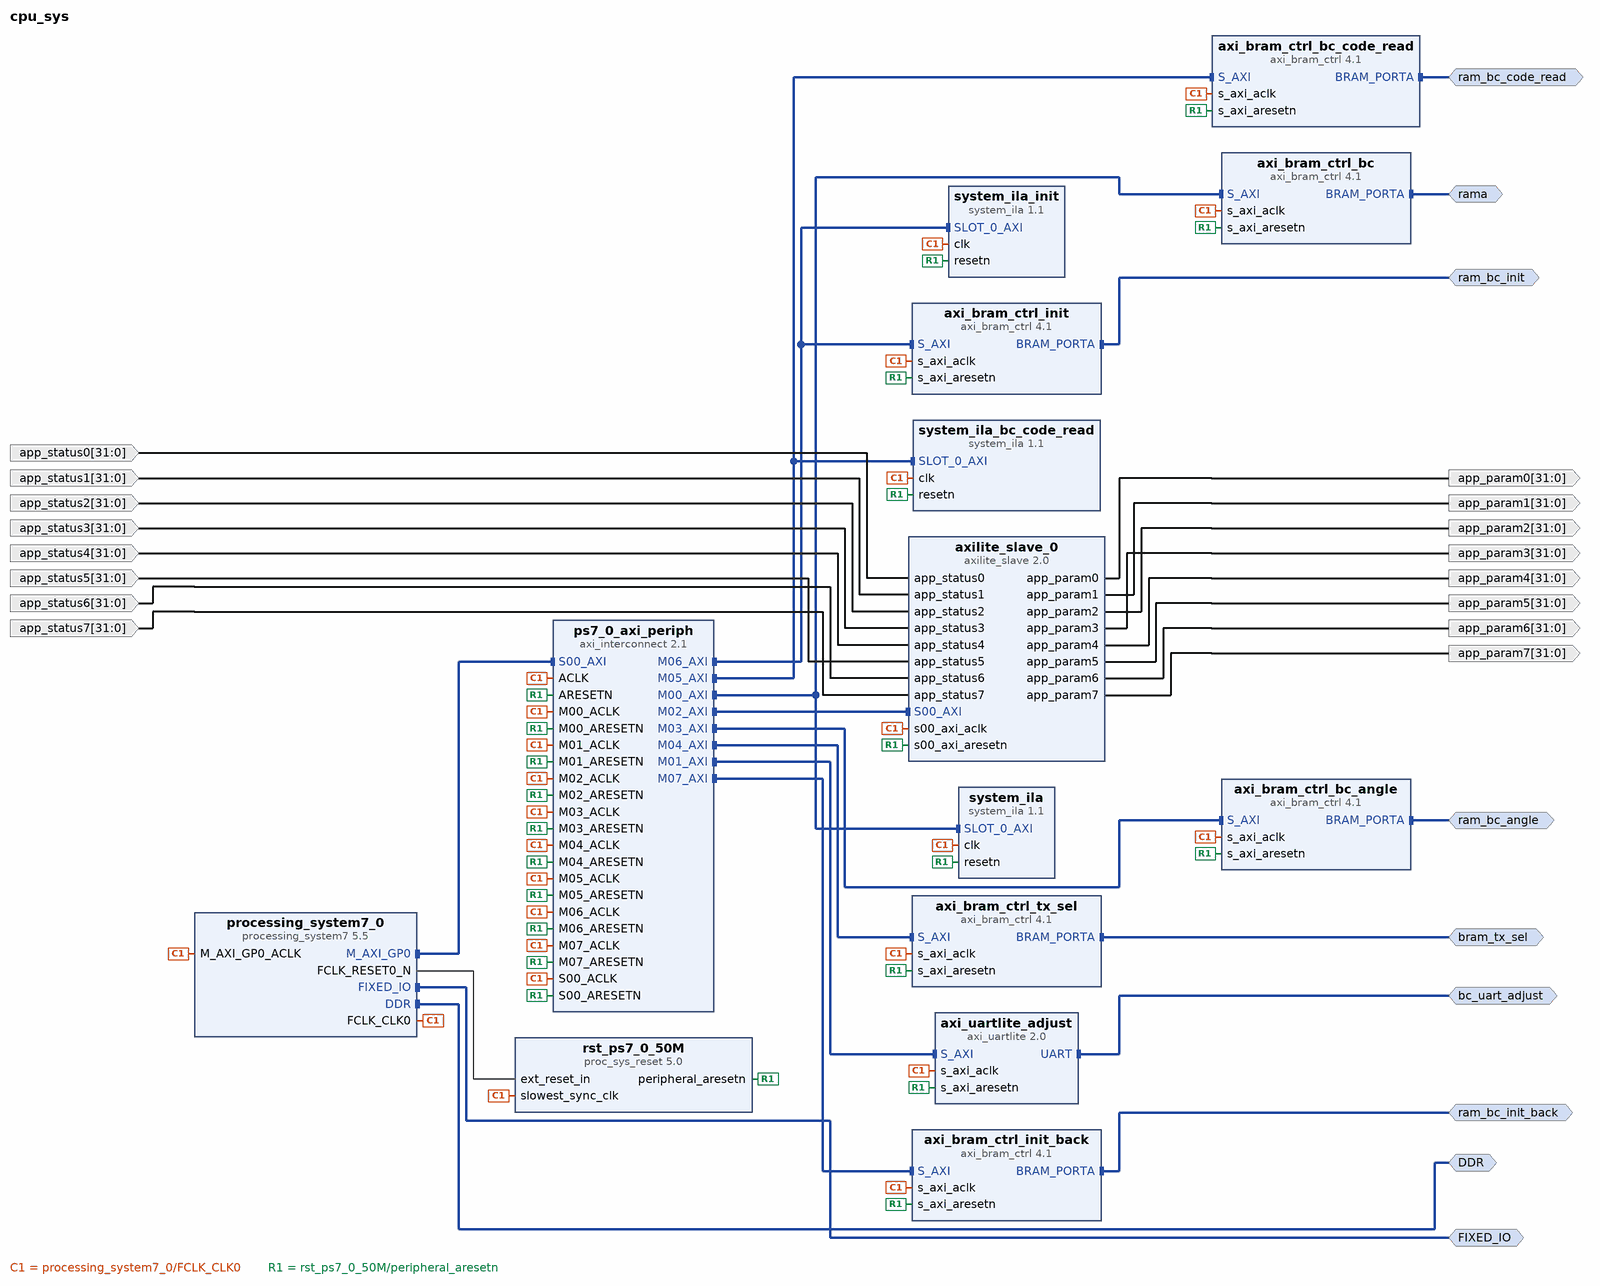
[diagram p0: block diagram of the top level]
# Vivado block design cpu_sys, xc7z020clg400-2, Vivado 2020.2
create_bd_design cpu_sys

create_bd_intf_port -mode Master -vlnv xilinx.com:interface:ddrx_rtl:1.0 DDR
create_bd_intf_port -mode Master -vlnv xilinx.com:display_processing_system7:fixedio_rtl:1.0 FIXED_IO
create_bd_intf_port -mode Master -vlnv xilinx.com:interface:uart_rtl:1.0 bc_uart_adjust
create_bd_intf_port -mode Master -vlnv xilinx.com:interface:bram_rtl:1.0 rama
set_property -dict {CONFIG.MASTER_TYPE BRAM_CTRL} [get_bd_intf_ports rama]
create_bd_intf_port -mode Master -vlnv xilinx.com:interface:bram_rtl:1.0 ram_bc_angle
set_property -dict {CONFIG.MASTER_TYPE BRAM_CTRL} [get_bd_intf_ports ram_bc_angle]
create_bd_intf_port -mode Master -vlnv xilinx.com:interface:bram_rtl:1.0 bram_tx_sel
set_property -dict {CONFIG.MASTER_TYPE BRAM_CTRL} [get_bd_intf_ports bram_tx_sel]
create_bd_intf_port -mode Master -vlnv xilinx.com:interface:bram_rtl:1.0 ram_bc_code_read
set_property -dict {CONFIG.MASTER_TYPE BRAM_CTRL} [get_bd_intf_ports ram_bc_code_read]
create_bd_intf_port -mode Master -vlnv xilinx.com:interface:bram_rtl:1.0 ram_bc_init
set_property -dict {CONFIG.MASTER_TYPE BRAM_CTRL} [get_bd_intf_ports ram_bc_init]
create_bd_intf_port -mode Master -vlnv xilinx.com:interface:bram_rtl:1.0 ram_bc_init_back
set_property -dict {CONFIG.MASTER_TYPE BRAM_CTRL} [get_bd_intf_ports ram_bc_init_back]
create_bd_port -dir O -from 31 -to 0 app_param0
create_bd_port -dir O -from 31 -to 0 app_param1
create_bd_port -dir O -from 31 -to 0 app_param2
create_bd_port -dir O -from 31 -to 0 app_param3
create_bd_port -dir O -from 31 -to 0 app_param4
create_bd_port -dir O -from 31 -to 0 app_param5
create_bd_port -dir O -from 31 -to 0 app_param6
create_bd_port -dir O -from 31 -to 0 app_param7
create_bd_port -dir I -from 31 -to 0 app_status0
create_bd_port -dir I -from 31 -to 0 app_status1
create_bd_port -dir I -from 31 -to 0 app_status2
create_bd_port -dir I -from 31 -to 0 app_status3
create_bd_port -dir I -from 31 -to 0 app_status4
create_bd_port -dir I -from 31 -to 0 app_status5
create_bd_port -dir I -from 31 -to 0 app_status6
create_bd_port -dir I -from 31 -to 0 app_status7

create_bd_cell -type ip -vlnv xilinx.com:ip:processing_system7:5.5 processing_system7_0
set_property -dict [list \
  CONFIG.PCW_APU_PERIPHERAL_FREQMHZ 666.666666 \
  CONFIG.PCW_CPU_CPU_6X4X_MAX_RANGE 767 \
  CONFIG.PCW_ENET0_ENET0_IO {MIO 16 .. 27} \
  CONFIG.PCW_ENET0_GRP_MDIO_ENABLE 1 \
  CONFIG.PCW_ENET0_GRP_MDIO_IO {MIO 52 .. 53} \
  CONFIG.PCW_ENET0_PERIPHERAL_ENABLE 1 \
  CONFIG.PCW_ENET0_RESET_ENABLE 0 \
  CONFIG.PCW_ENET_RESET_ENABLE 1 \
  CONFIG.PCW_ENET_RESET_SELECT {Share reset pin} \
  CONFIG.PCW_FPGA0_PERIPHERAL_FREQMHZ 50 \
  CONFIG.PCW_FPGA1_PERIPHERAL_FREQMHZ 50 \
  CONFIG.PCW_GPIO_MIO_GPIO_ENABLE 1 \
  CONFIG.PCW_GPIO_MIO_GPIO_IO MIO \
  CONFIG.PCW_I2C0_GRP_INT_ENABLE 0 \
  CONFIG.PCW_I2C0_I2C0_IO {MIO 50 .. 51} \
  CONFIG.PCW_I2C0_PERIPHERAL_ENABLE 1 \
  CONFIG.PCW_I2C_PERIPHERAL_FREQMHZ 111.111115 \
  CONFIG.PCW_I2C_RESET_ENABLE 1 \
  CONFIG.PCW_I2C_RESET_SELECT {Share reset pin} \
  CONFIG.PCW_PERIPHERAL_BOARD_PRESET None \
  CONFIG.PCW_PRESET_BANK1_VOLTAGE {LVCMOS 1.8V} \
  CONFIG.PCW_QSPI_GRP_FBCLK_ENABLE 1 \
  CONFIG.PCW_QSPI_GRP_FBCLK_IO {MIO 8} \
  CONFIG.PCW_QSPI_GRP_SINGLE_SS_ENABLE 1 \
  CONFIG.PCW_QSPI_GRP_SINGLE_SS_IO {MIO 1 .. 6} \
  CONFIG.PCW_QSPI_PERIPHERAL_ENABLE 1 \
  CONFIG.PCW_QSPI_QSPI_IO {MIO 1 .. 6} \
  CONFIG.PCW_SD0_GRP_CD_ENABLE 1 \
  CONFIG.PCW_SD0_GRP_CD_IO {MIO 47} \
  CONFIG.PCW_SD0_GRP_WP_ENABLE 0 \
  CONFIG.PCW_SD0_PERIPHERAL_ENABLE 1 \
  CONFIG.PCW_SD0_SD0_IO {MIO 40 .. 45} \
  CONFIG.PCW_SDIO_PERIPHERAL_FREQMHZ 100 \
  CONFIG.PCW_SINGLE_QSPI_DATA_MODE x4 \
  CONFIG.PCW_UART0_PERIPHERAL_ENABLE 1 \
  CONFIG.PCW_UART0_UART0_IO {MIO 10 .. 11} \
  CONFIG.PCW_UART1_PERIPHERAL_ENABLE 1 \
  CONFIG.PCW_UART1_UART1_IO {MIO 12 .. 13} \
  CONFIG.PCW_UART_PERIPHERAL_FREQMHZ 100 \
  CONFIG.PCW_UIPARAM_DDR_FREQ_MHZ 533.333333 \
  CONFIG.PCW_UIPARAM_DDR_PARTNO {MT41J256M16 RE-125} \
  CONFIG.PCW_USB0_PERIPHERAL_ENABLE 1 \
  CONFIG.PCW_USB0_RESET_ENABLE 1 \
  CONFIG.PCW_USB0_RESET_IO {MIO 46} \
  CONFIG.PCW_USB0_USB0_IO {MIO 28 .. 39} \
  CONFIG.PCW_USB_RESET_ENABLE 1 \
  CONFIG.PCW_USB_RESET_SELECT {Share reset pin} \
] [get_bd_cells processing_system7_0]
# 508 more settings of processing_system7_0 are not shown: defaults, MIO pin electricals, DDR timing, and values the tool derives
create_bd_cell -type ip -vlnv xilinx.com:ip:axi_interconnect:2.1 ps7_0_axi_periph
set_property -dict {CONFIG.NUM_MI 8} [get_bd_cells ps7_0_axi_periph]
create_bd_cell -type ip -vlnv xilinx.com:ip:proc_sys_reset:5.0 rst_ps7_0_50M
create_bd_cell -type ip -vlnv xilinx.com:ip:axi_uartlite:2.0 axi_uartlite_adjust
set_property -dict {CONFIG.C_BAUDRATE 115200} [get_bd_cells axi_uartlite_adjust]
create_bd_cell -type ip -vlnv xilinx.com:ip:axi_bram_ctrl:4.1 axi_bram_ctrl_bc
set_property -dict {CONFIG.READ_LATENCY 3 CONFIG.SINGLE_PORT_BRAM 1} [get_bd_cells axi_bram_ctrl_bc]
create_bd_cell -type ip -vlnv xilinx.com:user:axilite_slave:2.0 axilite_slave_0
create_bd_cell -type ip -vlnv xilinx.com:ip:axi_bram_ctrl:4.1 axi_bram_ctrl_bc_angle
set_property -dict {CONFIG.SINGLE_PORT_BRAM 1} [get_bd_cells axi_bram_ctrl_bc_angle]
create_bd_cell -type ip -vlnv xilinx.com:ip:axi_bram_ctrl:4.1 axi_bram_ctrl_tx_sel
set_property -dict {CONFIG.SINGLE_PORT_BRAM 1} [get_bd_cells axi_bram_ctrl_tx_sel]
create_bd_cell -type ip -vlnv xilinx.com:ip:axi_bram_ctrl:4.1 axi_bram_ctrl_bc_code_read
set_property -dict {CONFIG.SINGLE_PORT_BRAM 1} [get_bd_cells axi_bram_ctrl_bc_code_read]
create_bd_cell -type ip -vlnv xilinx.com:ip:system_ila:1.1 system_ila
create_bd_cell -type ip -vlnv xilinx.com:ip:system_ila:1.1 system_ila_bc_code_read
create_bd_cell -type ip -vlnv xilinx.com:ip:axi_bram_ctrl:4.1 axi_bram_ctrl_init
set_property -dict {CONFIG.SINGLE_PORT_BRAM 1} [get_bd_cells axi_bram_ctrl_init]
create_bd_cell -type ip -vlnv xilinx.com:ip:system_ila:1.1 system_ila_init
create_bd_cell -type ip -vlnv xilinx.com:ip:axi_bram_ctrl:4.1 axi_bram_ctrl_init_back
set_property -dict {CONFIG.SINGLE_PORT_BRAM 1} [get_bd_cells axi_bram_ctrl_init_back]

# ---- connections ----

connect_bd_intf_net [get_bd_intf_pins processing_system7_0/M_AXI_GP0] [get_bd_intf_pins ps7_0_axi_periph/S00_AXI]
connect_bd_intf_net [get_bd_intf_ports ram_bc_code_read] [get_bd_intf_pins axi_bram_ctrl_bc_code_read/BRAM_PORTA]
connect_bd_intf_net [get_bd_intf_pins ps7_0_axi_periph/M02_AXI] [get_bd_intf_pins axilite_slave_0/S00_AXI]
connect_bd_intf_net [get_bd_intf_pins ps7_0_axi_periph/M06_AXI] [get_bd_intf_pins axi_bram_ctrl_init/S_AXI]
connect_bd_intf_net [get_bd_intf_pins ps7_0_axi_periph/M06_AXI] [get_bd_intf_pins system_ila_init/SLOT_0_AXI]
connect_bd_intf_net [get_bd_intf_pins ps7_0_axi_periph/M03_AXI] [get_bd_intf_pins axi_bram_ctrl_bc_angle/S_AXI]
connect_bd_intf_net [get_bd_intf_ports bram_tx_sel] [get_bd_intf_pins axi_bram_ctrl_tx_sel/BRAM_PORTA]
connect_bd_intf_net [get_bd_intf_ports FIXED_IO] [get_bd_intf_pins processing_system7_0/FIXED_IO]
connect_bd_intf_net [get_bd_intf_pins ps7_0_axi_periph/M07_AXI] [get_bd_intf_pins axi_bram_ctrl_init_back/S_AXI]
connect_bd_intf_net [get_bd_intf_ports DDR] [get_bd_intf_pins processing_system7_0/DDR]
connect_bd_intf_net -intf_net axi_bram_ctrl_0_BRAM_PORTA1 [get_bd_intf_ports ram_bc_init_back] [get_bd_intf_pins axi_bram_ctrl_init_back/BRAM_PORTA]
connect_bd_intf_net [get_bd_intf_pins ps7_0_axi_periph/M05_AXI] [get_bd_intf_pins axi_bram_ctrl_bc_code_read/S_AXI]
connect_bd_intf_net [get_bd_intf_pins ps7_0_axi_periph/M05_AXI] [get_bd_intf_pins system_ila_bc_code_read/SLOT_0_AXI]
connect_bd_intf_net [get_bd_intf_pins ps7_0_axi_periph/M00_AXI] [get_bd_intf_pins axi_bram_ctrl_bc/S_AXI]
connect_bd_intf_net [get_bd_intf_pins ps7_0_axi_periph/M00_AXI] [get_bd_intf_pins system_ila/SLOT_0_AXI]
connect_bd_intf_net [get_bd_intf_ports ram_bc_angle] [get_bd_intf_pins axi_bram_ctrl_bc_angle/BRAM_PORTA]
connect_bd_intf_net [get_bd_intf_pins ps7_0_axi_periph/M01_AXI] [get_bd_intf_pins axi_uartlite_adjust/S_AXI]
connect_bd_intf_net [get_bd_intf_ports ram_bc_init] [get_bd_intf_pins axi_bram_ctrl_init/BRAM_PORTA]
connect_bd_intf_net [get_bd_intf_pins ps7_0_axi_periph/M04_AXI] [get_bd_intf_pins axi_bram_ctrl_tx_sel/S_AXI]
connect_bd_intf_net -intf_net axi_bram_ctrl_0_BRAM_PORTA [get_bd_intf_ports rama] [get_bd_intf_pins axi_bram_ctrl_bc/BRAM_PORTA]
connect_bd_intf_net -intf_net axi_uartlite_0_UART [get_bd_intf_ports bc_uart_adjust] [get_bd_intf_pins axi_uartlite_adjust/UART]
connect_bd_net [get_bd_pins processing_system7_0/FCLK_CLK0] \
  [get_bd_pins processing_system7_0/M_AXI_GP0_ACLK] [get_bd_pins ps7_0_axi_periph/S00_ACLK] \
  [get_bd_pins rst_ps7_0_50M/slowest_sync_clk] [get_bd_pins ps7_0_axi_periph/M00_ACLK] [get_bd_pins ps7_0_axi_periph/ACLK] \
  [get_bd_pins ps7_0_axi_periph/M01_ACLK] [get_bd_pins ps7_0_axi_periph/M02_ACLK] \
  [get_bd_pins axi_uartlite_adjust/s_axi_aclk] [get_bd_pins axi_bram_ctrl_bc/s_axi_aclk] \
  [get_bd_pins axilite_slave_0/s00_axi_aclk] [get_bd_pins axi_bram_ctrl_bc_angle/s_axi_aclk] \
  [get_bd_pins ps7_0_axi_periph/M03_ACLK] [get_bd_pins axi_bram_ctrl_tx_sel/s_axi_aclk] \
  [get_bd_pins ps7_0_axi_periph/M04_ACLK] [get_bd_pins axi_bram_ctrl_bc_code_read/s_axi_aclk] \
  [get_bd_pins ps7_0_axi_periph/M05_ACLK] [get_bd_pins system_ila/clk] [get_bd_pins system_ila_bc_code_read/clk] \
  [get_bd_pins axi_bram_ctrl_init/s_axi_aclk] [get_bd_pins ps7_0_axi_periph/M06_ACLK] [get_bd_pins system_ila_init/clk] \
  [get_bd_pins axi_bram_ctrl_init_back/s_axi_aclk] [get_bd_pins ps7_0_axi_periph/M07_ACLK]
connect_bd_net [get_bd_pins processing_system7_0/FCLK_RESET0_N] [get_bd_pins rst_ps7_0_50M/ext_reset_in]
connect_bd_net [get_bd_pins rst_ps7_0_50M/peripheral_aresetn] \
  [get_bd_pins ps7_0_axi_periph/S00_ARESETN] [get_bd_pins ps7_0_axi_periph/M00_ARESETN] \
  [get_bd_pins ps7_0_axi_periph/ARESETN] [get_bd_pins ps7_0_axi_periph/M01_ARESETN] \
  [get_bd_pins ps7_0_axi_periph/M02_ARESETN] [get_bd_pins axi_uartlite_adjust/s_axi_aresetn] \
  [get_bd_pins axi_bram_ctrl_bc/s_axi_aresetn] [get_bd_pins axilite_slave_0/s00_axi_aresetn] \
  [get_bd_pins axi_bram_ctrl_bc_angle/s_axi_aresetn] [get_bd_pins ps7_0_axi_periph/M03_ARESETN] \
  [get_bd_pins axi_bram_ctrl_tx_sel/s_axi_aresetn] [get_bd_pins ps7_0_axi_periph/M04_ARESETN] \
  [get_bd_pins axi_bram_ctrl_bc_code_read/s_axi_aresetn] [get_bd_pins ps7_0_axi_periph/M05_ARESETN] \
  [get_bd_pins system_ila/resetn] [get_bd_pins system_ila_bc_code_read/resetn] [get_bd_pins axi_bram_ctrl_init/s_axi_aresetn] \
  [get_bd_pins ps7_0_axi_periph/M06_ARESETN] [get_bd_pins system_ila_init/resetn] \
  [get_bd_pins axi_bram_ctrl_init_back/s_axi_aresetn] [get_bd_pins ps7_0_axi_periph/M07_ARESETN]
connect_bd_net [get_bd_pins axilite_slave_0/app_param0] [get_bd_ports app_param0]
connect_bd_net [get_bd_pins axilite_slave_0/app_param1] [get_bd_ports app_param1]
connect_bd_net [get_bd_pins axilite_slave_0/app_param2] [get_bd_ports app_param2]
connect_bd_net [get_bd_pins axilite_slave_0/app_param3] [get_bd_ports app_param3]
connect_bd_net [get_bd_pins axilite_slave_0/app_param4] [get_bd_ports app_param4]
connect_bd_net [get_bd_pins axilite_slave_0/app_param5] [get_bd_ports app_param5]
connect_bd_net [get_bd_pins axilite_slave_0/app_param6] [get_bd_ports app_param6]
connect_bd_net [get_bd_pins axilite_slave_0/app_param7] [get_bd_ports app_param7]
connect_bd_net -net app_status0_0_1 [get_bd_ports app_status0] [get_bd_pins axilite_slave_0/app_status0]
connect_bd_net -net app_status1_0_1 [get_bd_ports app_status1] [get_bd_pins axilite_slave_0/app_status1]
connect_bd_net -net app_status2_0_1 [get_bd_ports app_status2] [get_bd_pins axilite_slave_0/app_status2]
connect_bd_net -net app_status3_0_1 [get_bd_ports app_status3] [get_bd_pins axilite_slave_0/app_status3]
connect_bd_net -net app_status4_0_1 [get_bd_ports app_status4] [get_bd_pins axilite_slave_0/app_status4]
connect_bd_net -net app_status5_0_1 [get_bd_ports app_status5] [get_bd_pins axilite_slave_0/app_status5]
connect_bd_net -net app_status6_0_1 [get_bd_ports app_status6] [get_bd_pins axilite_slave_0/app_status6]
connect_bd_net -net app_status7_0_1 [get_bd_ports app_status7] [get_bd_pins axilite_slave_0/app_status7]

# ---- address map ----
assign_bd_address -offset 0x40000000 -range 512K -target_address_space [get_bd_addr_spaces processing_system7_0/Data] [get_bd_addr_segs axi_bram_ctrl_bc/S_AXI/Mem0]
assign_bd_address -offset 0x42000000 -range 32K -target_address_space [get_bd_addr_spaces processing_system7_0/Data] [get_bd_addr_segs axi_bram_ctrl_bc_angle/S_AXI/Mem0]
assign_bd_address -offset 0x43C00000 -range 64K -target_address_space [get_bd_addr_spaces processing_system7_0/Data] [get_bd_addr_segs axilite_slave_0/S00_AXI/S00_AXI_reg]
assign_bd_address -offset 0x44000000 -range 8K -target_address_space [get_bd_addr_spaces processing_system7_0/Data] [get_bd_addr_segs axi_bram_ctrl_tx_sel/S_AXI/Mem0]
assign_bd_address -offset 0x46000000 -range 8K -target_address_space [get_bd_addr_spaces processing_system7_0/Data] [get_bd_addr_segs axi_bram_ctrl_bc_code_read/S_AXI/Mem0]
assign_bd_address -offset 0x48000000 -range 8K -target_address_space [get_bd_addr_spaces processing_system7_0/Data] [get_bd_addr_segs axi_bram_ctrl_init/S_AXI/Mem0]
assign_bd_address -offset 0x4A000000 -range 8K -target_address_space [get_bd_addr_spaces processing_system7_0/Data] [get_bd_addr_segs axi_bram_ctrl_init_back/S_AXI/Mem0]

validate_bd_design
save_bd_design
